# Altium schematic sheet SH18 -  RS232.SchDoc
size 386 x 246 mm
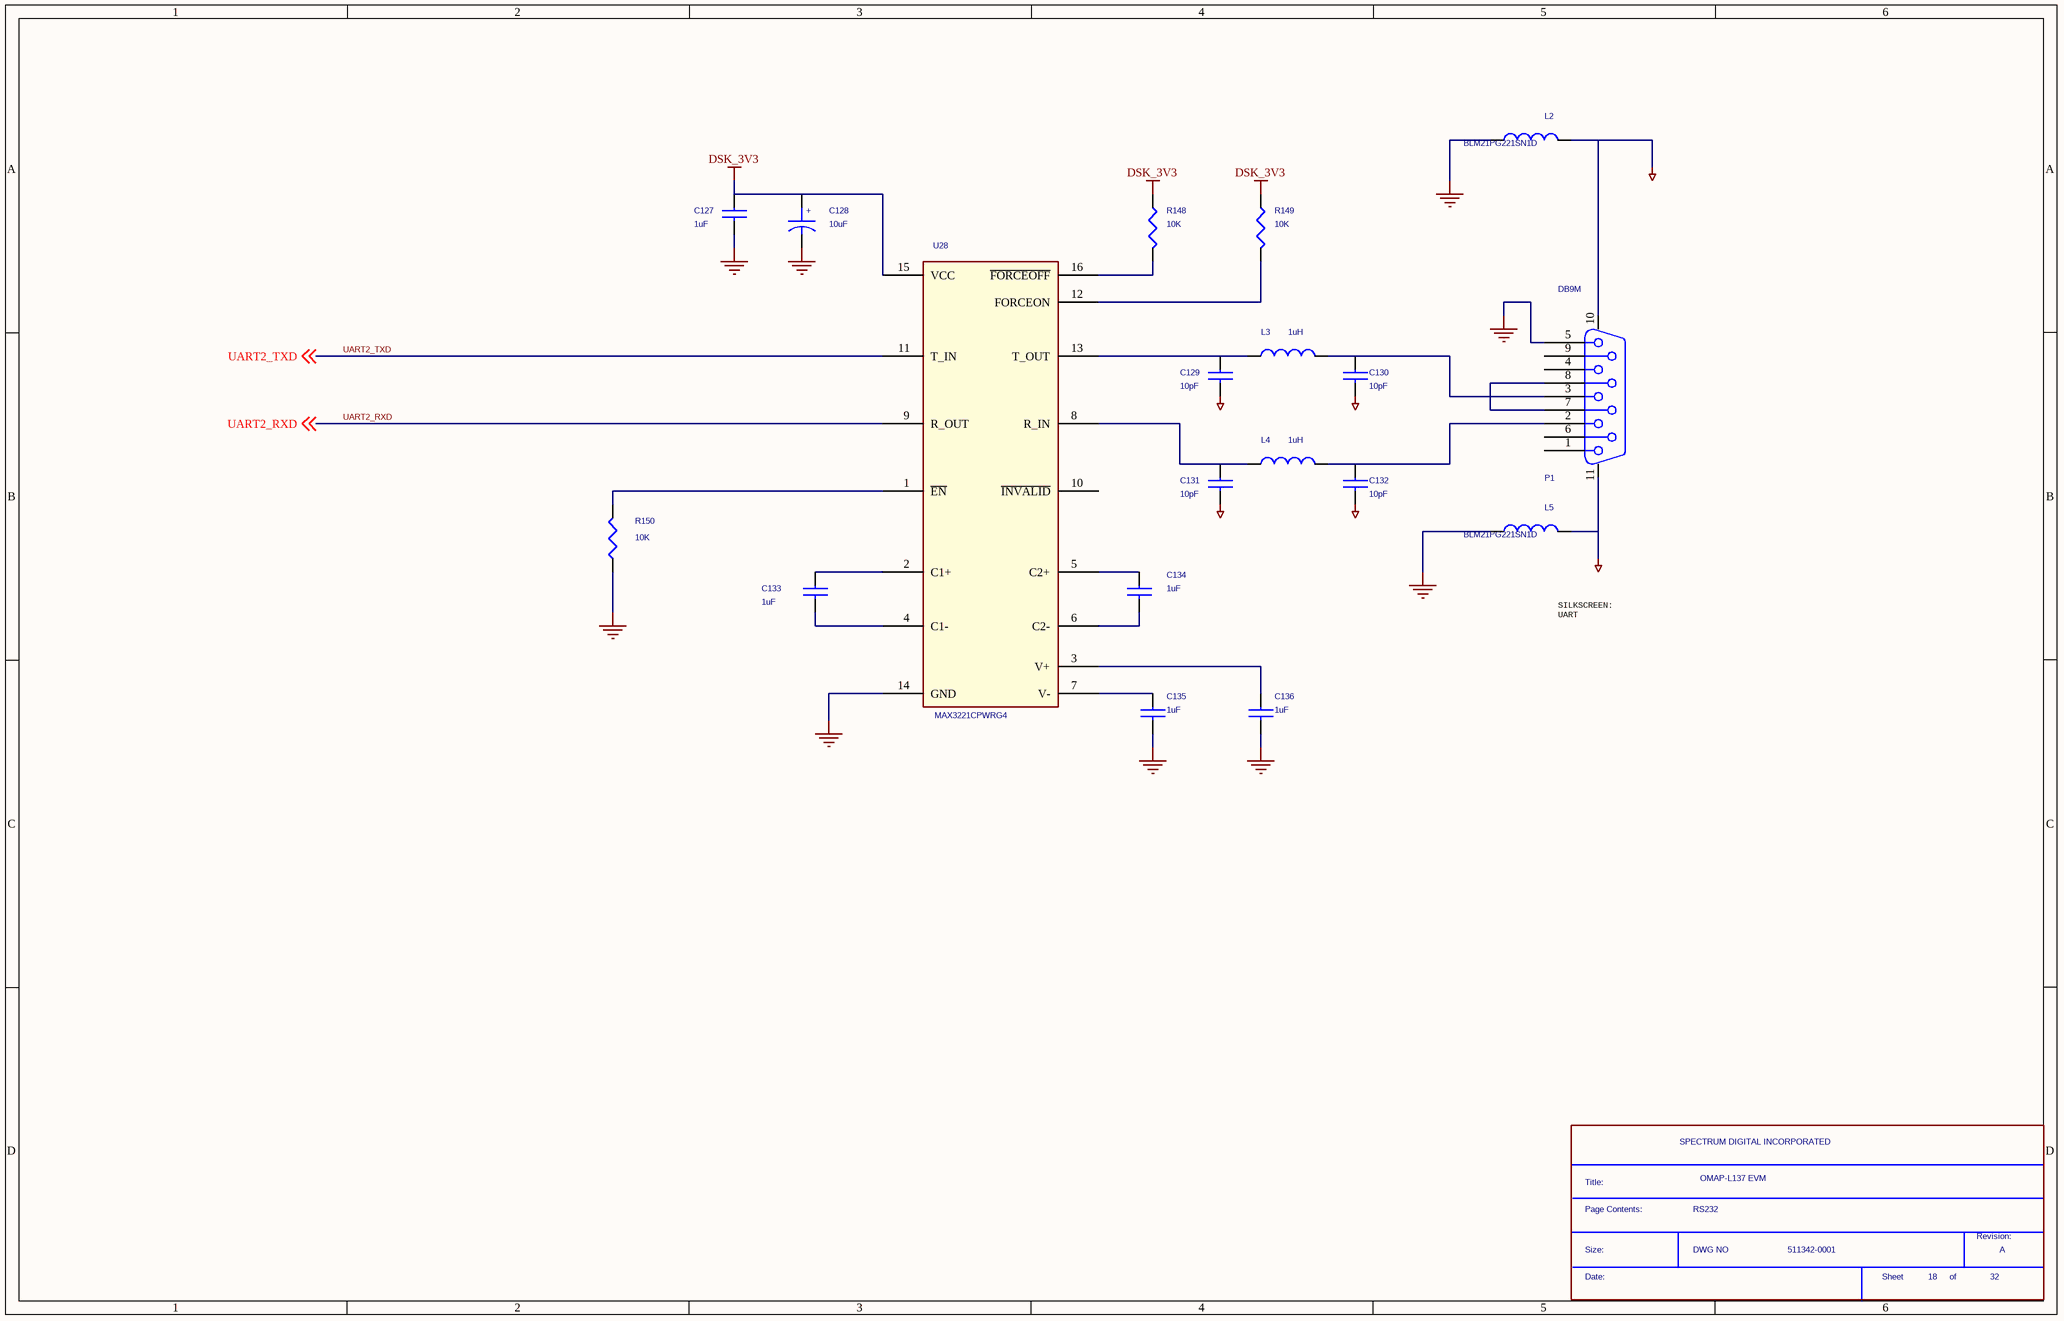
[diagram p0: SH18 -  RS232.SchDoc]

## Parts
*  Page Contents:: RS232  RevCode: A  Title: OMAP-L137 EVM  OrgName: SPECTRUM DIGITAL INCORPORATED  Doc: 511342-0001  Page Number: 18  Page Count: 32  (hidden comment: SDTitleBlock)  (graphical)
C127  1uF  [c603-35x45]
C128  10uF  [c1206-40x70-POL]
C129  10pF  [c603-35x45]
C130  10pF  [c603-35x45]
C131  10pF  [c603-35x45]
C132  10pF  [c603-35x45]
C133  1uF  [c603-35x45]
C134  1uF  [c603-35x45]
C135  1uF  [c603-35x45]
C136  1uF  [c603-35x45]
L2  BLM21PG221SN1D  [l805-35x60]
L3  1uH  [L805-35x60]
L4  1uH  [L805-35x60]
L5  BLM21PG221SN1D  [l805-35x60]
P1  DB9M  [DSUB-9-M]
R148  10K  [r402-25]
R149  10K  [r402-25]
R150  10K  [r402-25]
U28  MAX3221CPWRG4  [pw16-14x70]

## Nets
DSK_3V3: C127.1 C128.1 R148.1 R149.1 U28.15(VCC)
GND: C127.2 C128.2 C135.2 C136.2 L2.1 L5.1 P1.5 R150.1 U28.14(GND)
GND_E_RS232: C129.2 C130.2 C131.2 C132.2 L2.2 L5.2 P1.10 P1.11
UART2_RXD: U28.9(R_OUT) ; off-sheet UART2_RXD
UART2_TXD: U28.11(T_IN) ; off-sheet UART2_TXD
NetC129_1: C129.1 L3.1 U28.13(T_OUT)
NetC130_1: C130.1 L3.2 P1.3
NetC131_1: C131.1 L4.1 U28.8(R_IN)
NetC132_1: C132.1 L4.2 P1.2
NetC133_1: C133.1 U28.2(C1+)
NetC133_2: C133.2 U28.4(C1-)
NetC134_1: C134.1 U28.5(C2+)
NetC134_2: C134.2 U28.6(C2-)
NetC135_1: C135.1 U28.7(V-)
NetC136_1: C136.1 U28.3(V+)
NetP1_7: P1.7 P1.8
NetR148_2: R148.2 U28.16(~{FORCEOFF})
NetR149_2: R149.2 U28.12(FORCEON)
NetR150_2: R150.2 U28.1(~{EN})

Not connected (* = marked no-connect by the designer): P1 1 4 6 9; U28 10(~{INVALID})

## Notes on the sheet
- SILKSCREEN:
  UART
- (in symbol CAPACITOR POL_0) +
- (in symbol SDTitleBlock) Title:; Page Contents:; Revision:; Size:; DWG NO; Date:; Sheet; of

## Library data of the parts
C127 C133-C136 = CAP NP: Part #: 101007-0100R
C128 = CAPACITOR POL_0: Part #: 101003-0101R; Buy: D/K P#335 P2032-ND
C129-C132 = CAP NP: Part #: 101001-1104R
L2 L5 = INDUCTOR_0: Part #: 101228-2201R; Part Number: BLM21PG221SN1D
L3 L4 = INDUCTOR: Part #: 101584-0100R
P1 = DSUB9-Male: Part #: 100558-0009R; ATLStockNo1: 4500.xxxx; SD PCB Footprint: db9mrg
R148-R150 = RESISTOR: Part #: 101370-1003R
U28 = MAX3221_0: Part #: 101691-0001R